# Altium schematic sheet Decap_Banks.SchDoc
size A4; SheetNumber: 12; SheetTotal: 15
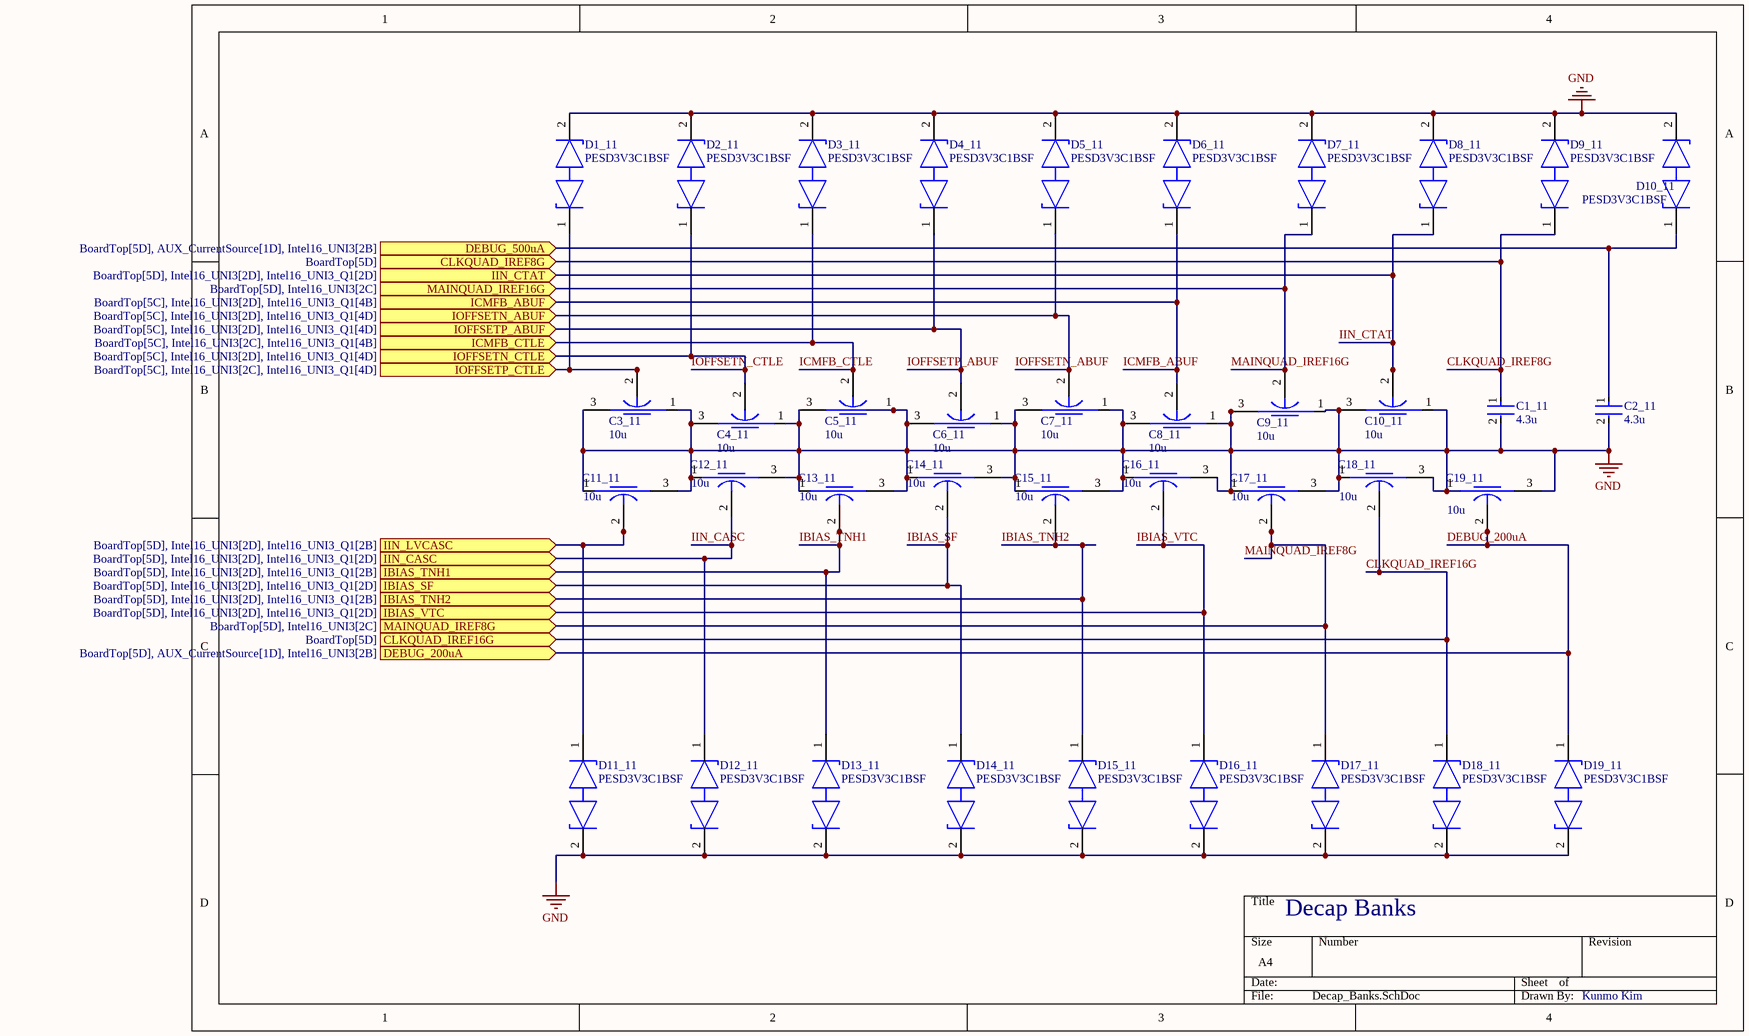
[diagram p0: Decap_Banks.SchDoc]

## Parts
C1_11  4.3u  [FP-LLL1U4-0_05-IPC_C]
C2_11  4.3u  [FP-LLL1U4-0_05-IPC_C]
C3_11  10u  [FP-NFM15-0_2-MFG]
C4_11  10u  [FP-NFM15-0_2-MFG]
C5_11  10u  [FP-NFM15-0_2-MFG]
C6_11  10u  [FP-NFM15-0_2-MFG]
C7_11  10u  [FP-NFM15-0_2-MFG]
C8_11  10u  [FP-NFM15-0_2-MFG]
C9_11  10u  [FP-NFM15-0_2-MFG]
C10_11  10u  [FP-NFM15-0_2-MFG]
C11_11  10u  [FP-NFM15-0_2-MFG]
C12_11  10u  [FP-NFM15-0_2-MFG]
C13_11  10u  [FP-NFM15-0_2-MFG]
C14_11  10u  [FP-NFM15-0_2-MFG]
C15_11  10u  [FP-NFM15-0_2-MFG]
C16_11  10u  [FP-NFM15-0_2-MFG]
C17_11  10u  [FP-NFM15-0_2-MFG]
C18_11  10u  [FP-NFM15-0_2-MFG]
C19_11  10u  [FP-NFM15-0_2-MFG]
D1_11  PESD3V3C1BSF  [FP-SOD962-2-MFG]
D2_11  PESD3V3C1BSF  [FP-SOD962-2-MFG]
D3_11  PESD3V3C1BSF  [FP-SOD962-2-MFG]
D4_11  PESD3V3C1BSF  [FP-SOD962-2-MFG]
D5_11  PESD3V3C1BSF  [FP-SOD962-2-MFG]
D6_11  PESD3V3C1BSF  [FP-SOD962-2-MFG]
D7_11  PESD3V3C1BSF  [FP-SOD962-2-MFG]
D8_11  PESD3V3C1BSF  [FP-SOD962-2-MFG]
D9_11  PESD3V3C1BSF  [FP-SOD962-2-MFG]
D10_11  PESD3V3C1BSF  [FP-SOD962-2-MFG]
D11_11  PESD3V3C1BSF  [FP-SOD962-2-MFG]
D12_11  PESD3V3C1BSF  [FP-SOD962-2-MFG]
D13_11  PESD3V3C1BSF  [FP-SOD962-2-MFG]
D14_11  PESD3V3C1BSF  [FP-SOD962-2-MFG]
D15_11  PESD3V3C1BSF  [FP-SOD962-2-MFG]
D16_11  PESD3V3C1BSF  [FP-SOD962-2-MFG]
D17_11  PESD3V3C1BSF  [FP-SOD962-2-MFG]
D18_11  PESD3V3C1BSF  [FP-SOD962-2-MFG]
D19_11  PESD3V3C1BSF  [FP-SOD962-2-MFG]

## Ports
CLKQUAD_IREF8G (in, see BoardTop[5D]), CLKQUAD_IREF16G (in, see BoardTop[5D]), DEBUG_200uA (in, see BoardTop[5D], AUX_CurrentSource[1D], Intel16_UNI3[2B]), DEBUG_500uA (in, see BoardTop[5D], AUX_CurrentSource[1D], Intel16_UNI3[2B]), IBIAS_SF (in, see BoardTop[5D], Intel16_UNI3[2D], Intel16_UNI3_Q1[2D]), IBIAS_TNH1 (in, see BoardTop[5D], Intel16_UNI3[2D], Intel16_UNI3_Q1[2B]), IBIAS_TNH2 (in, see BoardTop[5D], Intel16_UNI3[2D], Intel16_UNI3_Q1[2B]), IBIAS_VTC (in, see BoardTop[5D], Intel16_UNI3[2D], Intel16_UNI3_Q1[2D]), ICMFB_ABUF (in, see BoardTop[5C], Intel16_UNI3[2D], Intel16_UNI3_Q1[4B]), ICMFB_CTLE (in, see BoardTop[5C], Intel16_UNI3[2C], Intel16_UNI3_Q1[4B]), IIN_CASC (in, see BoardTop[5D], Intel16_UNI3[2D], Intel16_UNI3_Q1[2D]), IIN_CTAT (in, see BoardTop[5D], Intel16_UNI3[2D], Intel16_UNI3_Q1[2D]), IIN_LVCASC (in, see BoardTop[5D], Intel16_UNI3[2D], Intel16_UNI3_Q1[2B]), IOFFSETN_ABUF (in, see BoardTop[5C], Intel16_UNI3[2D], Intel16_UNI3_Q1[4D]), IOFFSETN_CTLE (in, see BoardTop[5C], Intel16_UNI3[2D], Intel16_UNI3_Q1[4D]), IOFFSETP_ABUF (in, see BoardTop[5C], Intel16_UNI3[2D], Intel16_UNI3_Q1[4D]), IOFFSETP_CTLE (in, see BoardTop[5C], Intel16_UNI3[2C], Intel16_UNI3_Q1[4D]), MAINQUAD_IREF8G (in, see BoardTop[5D], Intel16_UNI3[2C]), MAINQUAD_IREF16G (in, see BoardTop[5D], Intel16_UNI3[2C])

## Nets
GND: C1_11.2 C2_11.2 C3_11.1(Input) C3_11.3(Output) C4_11.1(Input) C4_11.3(Output) C5_11.1(Input) C5_11.3(Output) C6_11.1(Input) C6_11.3(Output) C7_11.1(Input) C7_11.3(Output) C8_11.1(Input) C8_11.3(Output) C9_11.1(Input) C9_11.3(Output) C10_11.1(Input) C10_11.3(Output) C11_11.1(Input) C11_11.3(Output) C12_11.1(Input) C12_11.3(Output) C13_11.1(Input) C13_11.3(Output) C14_11.1(Input) C14_11.3(Output) C15_11.1(Input) C15_11.3(Output) C16_11.1(Input) C16_11.3(Output) C17_11.1(Input) C17_11.3(Output) C18_11.1(Input) C18_11.3(Output) C19_11.1(Input) C19_11.3(Output) D1_11.2(K2) D2_11.2(K2) D3_11.2(K2) D4_11.2(K2) D5_11.2(K2) D6_11.2(K2) D7_11.2(K2) D8_11.2(K2) D9_11.2(K2) D10_11.2(K2) D11_11.2(K2) D12_11.2(K2) D13_11.2(K2) D14_11.2(K2) D15_11.2(K2) D16_11.2(K2) D17_11.2(K2) D18_11.2(K2) D19_11.2(K2)
CLKQUAD_IREF8G: C1_11.1 D9_11.1(K1) ; port CLKQUAD_IREF8G
CLKQUAD_IREF16G: C18_11.2(GND) D18_11.1(K1) ; port CLKQUAD_IREF16G
DEBUG_200uA: C19_11.2(GND) D19_11.1(K1) ; port DEBUG_200uA
DEBUG_500uA: C2_11.1 D10_11.1(K1) ; port DEBUG_500uA
IBIAS_SF: C14_11.2(GND) D14_11.1(K1) ; port IBIAS_SF
IBIAS_TNH1: C13_11.2(GND) D13_11.1(K1) ; port IBIAS_TNH1
IBIAS_TNH2: C15_11.2(GND) D15_11.1(K1) ; port IBIAS_TNH2
IBIAS_VTC: C16_11.2(GND) D16_11.1(K1) ; port IBIAS_VTC
ICMFB_ABUF: C8_11.2(GND) D6_11.1(K1) ; port ICMFB_ABUF
ICMFB_CTLE: C5_11.2(GND) D3_11.1(K1) ; port ICMFB_CTLE
IIN_CASC: C12_11.2(GND) D12_11.1(K1) ; port IIN_CASC
IIN_CTAT: C10_11.2(GND) D8_11.1(K1) ; port IIN_CTAT
IIN_LVCASC: C11_11.2(GND) D11_11.1(K1) ; port IIN_LVCASC
IOFFSETN_ABUF: C7_11.2(GND) D5_11.1(K1) ; port IOFFSETN_ABUF
IOFFSETN_CTLE: C4_11.2(GND) D2_11.1(K1) ; port IOFFSETN_CTLE
IOFFSETP_ABUF: C6_11.2(GND) D4_11.1(K1) ; port IOFFSETP_ABUF
IOFFSETP_CTLE: C3_11.2(GND) D1_11.1(K1) ; port IOFFSETP_CTLE
MAINQUAD_IREF8G: C17_11.2(GND) D17_11.1(K1) ; port MAINQUAD_IREF8G
MAINQUAD_IREF16G: C9_11.2(GND) D7_11.1(K1) ; port MAINQUAD_IREF16G

## Notes on the sheet
- Decap Banks
- Kunmo Kim

## Library data of the parts
C1_11 C2_11 = CMP-06035-061933-1: Cap Ceramic Monolithic 4.3uF 20% 4V X5R 15% 02404 (0610M); Capacitance: 4.3uF; Tolerance: 20%; Min Operating Temperature: -55°C; Case/Package: 0204; Voltage Rating: 4V; Mount: Surface Mount; Max Operating Temperature: 85°C; Packaging: Tape and Reel; RoHS Compliant: Yes
C3_11 C4_11 C5_11 C6_11 C7_11 C8_11 C9_11 C10_11 C11_11 C12_11 C13_11 C14_11 C15_11 C16_11 C17_11 C18_11 C19_11 = CMP-06053-000058-1: CAP FEEDTHRU
D1_11 D2_11 D3_11 D4_11 D5_11 D6_11 D7_11 D8_11 D9_11 D10_11 D11_11 D12_11 D13_11 D14_11 D15_11 D16_11 D17_11 D18_11 D19_11 = CMP-14436-000022-1: TVS DIODE 2VWM 3VC DSN0603-2